# Altium schematic sheet Middle_TID_B.SchDoc
size A4
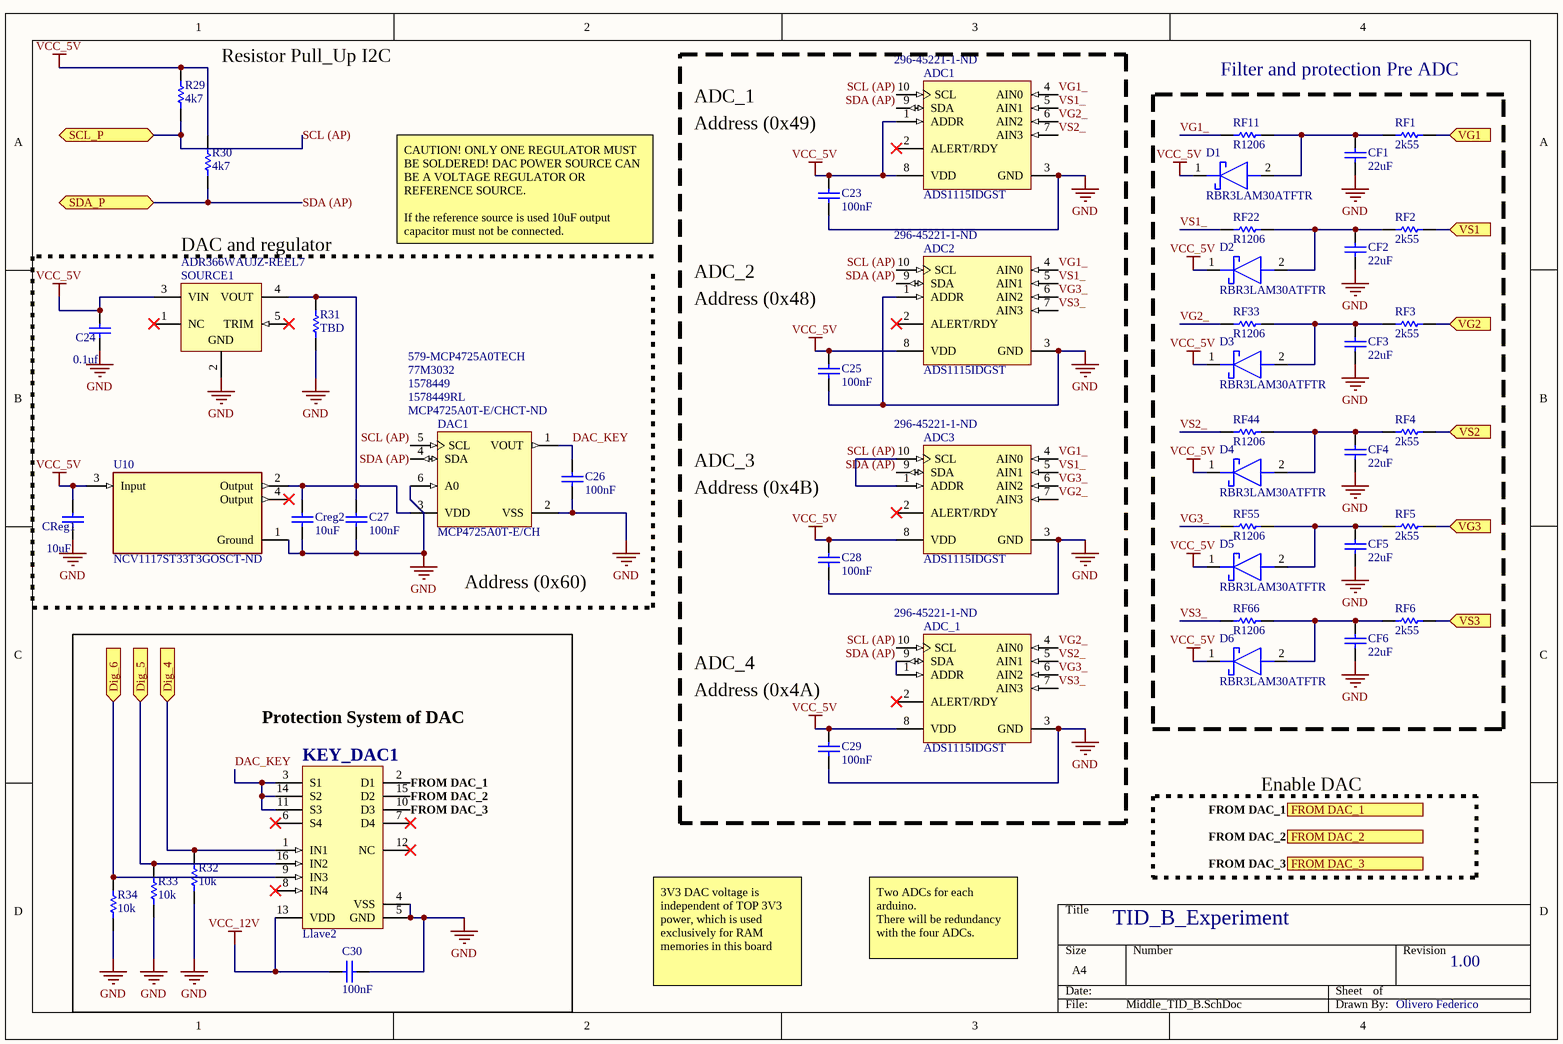
[diagram p0: Middle_TID_B.SchDoc]

## Parts
ADC1  ADS1115IDGST  Supplier Part Number 1: 296-45221-1-ND  [TI-DGS10_N]
ADC2  ADS1115IDGST  Supplier Part Number 1: 296-45221-1-ND  [TI-DGS10_N]
ADC3  ADS1115IDGST  Supplier Part Number 1: 296-45221-1-ND  [TI-DGS10_N]
ADC_1  ADS1115IDGST  Supplier Part Number 1: 296-45221-1-ND  [TI-DGS10_N]
C23  100nF  [C1206]
C24  0.1uf  [C1206]
C25  100nF  [C1206]
C26  100nF  [C1206]
C27  100nF  [C1206]
C28  100nF  [C1206]
C29  100nF  [C1206]
C30  100nF  [C1206]
CF1  22uF  [C1206]
CF2  22uF  [C1206]
CF3  22uF  [C1206]
CF4  22uF  [C1206]
CF5  22uF  [C1206]
CF6  22uF  [C1206]
CReg1  10uF  [C1206]
Creg2  10uF  [C1206]
D1  RBR3LAM30ATFTR  [SODFL4725X105N]
D2  RBR3LAM30ATFTR  [SODFL4725X105N]
D3  RBR3LAM30ATFTR  [SODFL4725X105N]
D4  RBR3LAM30ATFTR  [SODFL4725X105N]
D5  RBR3LAM30ATFTR  [SODFL4725X105N]
D6  RBR3LAM30ATFTR  [SODFL4725X105N]
DAC1  MCP4725A0T-E/CH  Supplier Part Number 1: MCP4725A0T-E/CHCT-ND  Supplier Part Number 2: 1578449RL  Supplier Part Number 3: 1578449  Supplier Part Number 4: 77M3032  Supplier Part Number 5: 579-MCP4725A0TECH  [SOT-23-CH6_N]
KEY_DAC1  Llave2  [ADI-RU-16_N]
R29  4k7  [R1206]
R30  4k7  [R1206]
R31  TBD  [R1206]
R32  10k  [R1206]
R33  10k  [R1206]
R34  10k  [R1206]
RF1  2k55  [R1206]
RF2  2k55  [R1206]
RF3  2k55  [R1206]
RF4  2k55  [R1206]
RF5  2k55  [R1206]
RF6  2k55  [R1206]
RF11  R1206  [R1206]
RF22  R1206  [R1206]
RF33  R1206  [R1206]
RF44  R1206  [R1206]
RF55  R1206  [R1206]
RF66  R1206  [R1206]
SOURCE1  ADR366WAUJZ-REEL7  [ADI-UJ-5_M]
U10  NCV1117ST33T3GOSCT-ND  [FP-318H-MFG]

## Blocks framed on the sheet
Filter and protection Pre ADC: CF1-CF6 D1-D6 RF1-RF6 RF11 RF22 RF33 RF44 RF55 RF66

## Ports
Dig_4 (in), Dig_5 (in), Dig_6 (in), FROM DAC_1 (out), FROM DAC_2 (out), FROM DAC_3 (out), SCL_P (bidir), SDA_P (bidir), VG1 (in), VG2 (in), VG3 (in), VS1 (in), VS2 (in), VS3 (in)

## Nets
GND: ADC1.3(GND) ADC2.1(ADDR) ADC2.3(GND) ADC3.3(GND) ADC_1.3(GND) C23.1 C24.2 C25.1 C26.1 C27.1 C28.1 C29.1 C30.1 CF1.1 CF2.1 CF3.1 CF4.1 CF5.1 CF6.1 CReg1.2 Creg2.1 DAC1.2(VSS) DAC1.6(A0) KEY_DAC1.4(VSS) KEY_DAC1.5(GND) R31.1 R32.1 R33.1 R34.1 SOURCE1.2(GND) U10.1(Ground)
VCC_5V: ADC1.1(ADDR) ADC1.8(VDD) ADC2.8(VDD) ADC3.8(VDD) ADC_1.8(VDD) C23.2 C24.1 C25.2 C28.2 C29.2 CReg1.1 D1.1(K) D2.1(K) D3.1(K) D4.1(K) D5.1(K) D6.1(K) R29.2 R30.2 SOURCE1.3(VIN) U10.3(Input)
VCC_12V: C30.2 KEY_DAC1.13(VDD)
DAC_KEY: C26.2 DAC1.1(VOUT) KEY_DAC1.3(S1) KEY_DAC1.11(S3) KEY_DAC1.14(S2)
Dig_4: KEY_DAC1.1(IN1) R32.2 ; port Dig_4
Dig_5: KEY_DAC1.16(IN2) R33.2 ; port Dig_5
Dig_6: KEY_DAC1.9(IN3) R34.2 ; port Dig_6
FROM DAC_1: KEY_DAC1.2(D1) ; port FROM DAC_1
FROM DAC_2: KEY_DAC1.15(D2) ; port FROM DAC_2
FROM DAC_3: KEY_DAC1.10(D3) ; port FROM DAC_3
SCL (AP): ADC1.10(SCL) ADC2.10(SCL) ADC3.1(ADDR) ADC3.10(SCL) ADC_1.10(SCL) DAC1.5(SCL) R29.1 ; port SCL_P
SDA (AP): ADC1.9(SDA) ADC2.9(SDA) ADC3.9(SDA) ADC_1.1(ADDR) ADC_1.9(SDA) DAC1.4(SDA) R30.1 ; port SDA_P
VG1: RF1.2 ; port VG1
VG1_: ADC1.4(AIN0) ADC2.4(AIN0) ADC3.4(AIN0) RF11.1
VG2: RF3.2 ; port VG2
VG2_: ADC1.6(AIN2) ADC3.7(AIN3) ADC_1.4(AIN0) RF33.1
VG3: RF5.2 ; port VG3
VG3_: ADC2.6(AIN2) ADC3.6(AIN2) ADC_1.6(AIN2) RF55.1
VS1: RF2.2 ; port VS1
VS1_: ADC1.5(AIN1) ADC2.5(AIN1) ADC3.5(AIN1) RF22.1
VS2: RF4.2 ; port VS2
VS2_: ADC1.7(AIN3) ADC_1.5(AIN1) RF44.1
VS3: RF6.2 ; port VS3
VS3_: ADC2.7(AIN3) ADC_1.7(AIN3) RF66.1
NetC27_2: C27.2 Creg2.2 DAC1.3(VDD) R31.2 SOURCE1.4(VOUT) U10.2(Output)
NetCF1_2: CF1.2 D1.2(A) RF1.1 RF11.2
NetCF2_2: CF2.2 D2.2(A) RF2.1 RF22.2
NetCF3_2: CF3.2 D3.2(A) RF3.1 RF33.2
NetCF4_2: CF4.2 D4.2(A) RF4.1 RF44.2
NetCF5_2: CF5.2 D5.2(A) RF5.1 RF55.2
NetCF6_2: CF6.2 D6.2(A) RF6.1 RF66.2

Not connected (* = marked no-connect by the designer): ADC1 2(ALERT/RDY)*; ADC2 2(ALERT/RDY)*; ADC3 2(ALERT/RDY)*; ADC_1 2(ALERT/RDY)*; KEY_DAC1 6(S4)* 7(D4)* 8(IN4)* 12(NC)*; SOURCE1 1(NC)* 5(TRIM)*; U10 4(Output)*

## Notes on the sheet
- (near R29) Resistor Pull_Up I2C
- ADC_1
- Address (0x49)
- DAC and regulator
- CAUTION! ONLY ONE REGULATOR MUST BE SOLDERED! DAC POWER SOURCE CAN BE A VOLTAGE REGULATOR OR REFERENCE SOURCE.
  If the reference source is used 10uF output capacitor must not be connected.
- Address (0x48)
- ADC_2
- Address (0x4B)
- ADC_3
- Address (0x60)
- Protection System of DAC
- (near C29) Address (0x4A)
- ADC_4
- Enable DAC
- TID_B_Experiment
- 3V3 DAC voltage is independent of TOP 3V3 power, which is used exclusively for RAM memories in this board
- Two ADCs for each arduino.
  There will be redundancy with the four ADCs.
- 1.00
- Olivero Federico

## Library data of the parts
ADC1-ADC3 ADC_1 = ADS1115IDGST: 16-Bit ADC with Integrated Multiplexer, PGA, Comparator, Oscillator, and Reference, -40 to 125 degC, 10-pin SOP (DGS10), Green (RoHS & no Sb/Br); Manufacturer: Texas Instruments; # Input Channels: 4; Analog Voltage AV/DD(Max)(V): 5.5; Analog Voltage AV/DD(Min)(V): 2; Architecture: Delta-Sigma; INL(Max)(+/-LSB): 1; Interface: Serial I2C; Resolution(Bits): 16; Sample Rate (max)(SPS): 860; SubFamily: Precision ADC (<=10MSPS); DatasheetVersion: SBAS444B; PackageVersion: 4073272/C, 02/2004; PackageReference: DGS10; PackageDescription: 10-Pin Plastic Small Outline, Body 3 x 3 mm, Pitch 0.5 mm; Digital Supply(Max)(V): 5.5; Digital Supply(Min)(V): 2; Eco-Plan: Green (RoHS & no Sb/Br); Mounting Technology: Surface Mount; Code_JEDEC: MO-153; PartNumber: ADS1115IDGST; ComponentLink1Description: Manufacturer URL; ComponentLink1URL: http://www.ti.com/; ComponentLink2Description: Datasheet; ComponentLink2URL: http://www.ti.com/general/docs/lit/getliterature.tsp?genericPartNumber=ADS1115&fileType=pdf; ComponentLink3Description: Package Specification; ComponentLink3URL: http://www.ti.com/lit/ml/mpds035b/mpds035b.pdf; Supplier 1: Digi-Key
C23-C30 CF1-CF6 CReg1 Creg2 = C1206: 1206 Capacitor; Supplier 1: Digi-Key
  C23-C30: Supplier Part Number 1: 478-1556-1-ND
  CF1-CF6: Supplier Part Number 1: 490-4843-1-ND
  CReg1 Creg2: Supplier Part Number 1: 478-3811-1-ND
D1-D6 = RBR3LAM30ATFTR: Schottky Diode; Manufacturer_Name: ROHM Semiconductor; Datasheet Link: https://componentsearchengine.com/Datasheets/2/RBR3LAM30ATFTR.pdf; Height: 1.05mm; Manufacturer_Part_Number: RBR3LAM30ATFTR; Mouser Part Number: 755-RBR3LAM30ATFTR; Mouser Price/Stock: https://www.mouser.co.uk/ProductDetail/ROHM-Semiconductor/RBR3LAM30ATFTR?qs=4v%252BiZTmLVHGRR7OWAomL%252Bg%3D%3D
DAC1 = MCP4725A0T-E/CH: 12-Bit Digital-to-Analog Converter with EEPROM Memory in SOT-23-6, 6-Pin SOT-23, Extended Temperature, Tape and Reel; Manufacturer: Microchip; DatasheetVersion: revD, Jun-2009; PackageVersion: revBB, Aug-2009; PackageReference: SOT-23-CH6; PackageDescription: 6-Lead Plastic Small Outline Transistor (CH) [SOT-23]; Mounting Technology: Surface Mount; Code_IPC: SOT26A-6; PartNumber: MCP4725A0T-E/CH; ComponentLink1Description: Manufacturer URL; ComponentLink1URL: http://www.microchip.com/; ComponentLink2Description: Datasheet; ComponentLink2URL: http://ww1.microchip.com/downloads/en/DeviceDoc/22039d.pdf; ComponentLink3Description: Package Specification; ComponentLink3URL: http://www.microchip.com/stellent/groups/techpub_sg/documents/packagingspec/en012702.pdf; Supplier 1: Digi-Key; Supplier 2: Farnell; Supplier 3: Farnell; Supplier 4: Newark; Supplier 5: Mouser
KEY_DAC1 = ADG5412BRUZ: High Voltage Latch-Up Proof, Quad SPST Switches, -40 to 125 degC, 16-pin SOP (RU-16), Tube; Manufacturer: Analog Devices; Id, Is (ON): 100pA, 100pA, 100pA, 100pA; Is OFF: 50pA, 50pA, 50pA, 50pA; Power Dissipation: 1mW; Ron (ohms): 9; DatasheetVersion: Rev. A; PackageVersion: Nov-02; PackageReference: RU-16; PackageDescription: 16-Pin Thin Shrink Small Outline Package, Body 5 x 4.4 mm, Pitch 0.65 mm; Supplier 1: Digi-Key; Supplier Part Number 1: ADG5412BRUZ-ND; Supplier 2: Farnell; Supplier Part Number 2: 2081057; Supplier 3: Newark; Supplier Part Number 3: 85R6320; Supplier 4: Mouser; Supplier Part Number 4: 584-ADG5412BRUZ; Configuration: SPST; Packing: Tube; Mounting Technology: Surface Mount; Code_JEDEC: MO-153AB; PartNumber: ADG5412BRUZ; ComponentLink1Description: Manufacturer URL; ComponentLink1URL: http://www.analog.com/en/index.html; ComponentLink2Description: Datasheet; ComponentLink2URL: http://www.analog.com/static/imported-files/data_sheets/ADG5412_5413.pdf; ComponentLink3Description: Package Specification; ComponentLink3URL: http:/www.analog.com/static/imported-files/packages/36244347913743854010197452789RU16.pdf
R29-R34 RF1-RF6 RF11 RF22 RF33 RF44 RF55 RF66 = R1206: 1206 Resistor; Value: *
  R29 R30: Supplier 1: Digi-Key; Supplier Part Number 1: 541-4.7KECT-ND
  R32-R34: Supplier 1: Digi-Key; Supplier Part Number 1: 541-CRCW120610K0JNTACT-ND
  RF1-RF6: Supplier 1: Digi-Key; Supplier Part Number 1: 541-2.55KFCT-ND
SOURCE1 = CMP-0784-00514-1: Low Power, Low Noise Voltage Reference with Sink / Source Capability, 3.3 V Output, 3.6 to 15 V Supply, Automotive, 5-pin SOT23 (UJ-5), Reel; Manufacturer: Analog Devices; Max V Supply (V): 15; Vout: 3.3V; Automotive Qualified: Yes; Min V Supply (V): 3.6; Ref Out TC (ppm/C): 25; ComponentLink1URL: http://www.analog.com/en/index.html; ComponentLink4URL: Product URL:http://www.analog.com/en/special-linear-functions/voltage-references/adr366/products/product.html; ComponentLink1Description: Manufacturer URL; Operating Temp Range: -40 to 125 degC; ComponentLink4Description: URL Link1; DatasheetVersion: Rev. D; PackageReference: UJ-5; PackageDescription: 5-Pin Thin Small Outline Transistor Package, Body 2.9 x 1.6 mm, Pitch 0.95 mm; PartNumber: ADR366WAUJZ-REEL7; Mounting Technology: Surface Mount; Code_JEDEC: MO-193-AB; ComponentLink2Description: Datasheet; ComponentLink3Description: Package Specification; Packing: Reel; ComponentLink2URL: http://www.analog.com/static/imported-files/data_sheets/ADR360_361_363_364_365_366.pdf; ComponentLink3URL: http:/www.analog.com/static/imported-files/packages/PKG_PDF/TSOT(UJ)/UJ_5.pdf; PackageVersion: 100708-A, 10/2008; Supplier 1: Digi-Key
U10 = CMP-07128-000021-1: IC REG LINEAR 3.3V 1A SOT223; Manufacturer: ON Semiconductor; Nominal Supply Current: 6mA; Min Supply Voltage: 2.4V; Number Of Outputs: 1; Standoff Height: 0.02mm; Automotive Grade: Grade 0; Accuracy Percentage: 1%; Max Junction Temp: +150°C; Output Type: Fixed; Dropout Voltage: 1.07V; Max Supply Voltage: 20V; Polarity: Positive; Quiescent Current: 10mA; Package: 318H; ComponentLink2Description: Datasheet; Output Current: 1A; Device Class L1: Integrated Circuits (ICs); Ambient Temperature Range Low: -40°C; Output Voltage: 3.3V; Octopart: https://octopart.com/ncv1117st33t3g-on+semiconductor-1215835; Manufacturer Part Number: NCV1117ST33T3G; Device Class L2: Power Management ICs; ComponentLink2URL: https://www.onsemi.com/pub/Collateral/NCP1117-D.PDF; Ipc Land Pattern Name: SOT230P700X180-4; Digikey Description: IC REG LINEAR 3.3V 1A SOT223; Height: 1.8mm; Ambient Temperature Range High: +125°C; Mouser Description: LDO Voltage Regulators 3.3V 1.0A Automotive; Category: IC; Temperature: -55°C to +150°C; Automotive: Yes; Temperature Range Low: -55°C; Temperature Range High: +150°C; Lead Free: Yes; Device Class L3: Voltage Regulators - Linear; RoHS: TRUE; ComponentLink3Description: New link; ComponentLink3URL: *; Supplier 1: Digi-Key; Supplier 2: Digi-Key; Stock 2: 7309; Pricing 2: 1=0,67000, 10=0,57500, 25=0,53640, 100=0,39850, 250=0,33720, 500=0,32188, 1000=0,23758 (USD); Mount: Surface Mount; Case/Package: SOT-223; Number of Pins: 3; Contact Plating: Tin,Matte; Min Operating Temperature: -40°C; Max Operating Temperature: 125°C; Package Quantity: 1; Packaging: Tape and Reel; Max Input Voltage: 20V; Number of Regulators: 1; Min Current Limit: 1A; Input Bias Current: 6mA; Max Output Current: 1A; Nominal Output Voltage: 3.3V; Accuracy: 1%; Output Voltage Accuracy: 1%; Series: Automotive, AEC-Q100; Length: 6.7mm; Width: 3.7mm; Radiation Hardening: No; REACH SVHC: No SVHC; RoHS Compliant: Yes; ComponentLink1URL: https://datasheet.ciiva.com/2061/ncp1117-d-2061392.pdf?src-supplier=Digi-Key; ComponentLink1Description: https://datasheet.ciiva.com/2061/ncp1117-d-2061392.pdf?src-supplier=Digi-Key; ComponentLink4URL: https://datasheet.ciiva.com/2061/ncp1117-d-2061390.pdf?src-supplier=Digi-Key; ComponentLink4Description: https://datasheet.ciiva.com/2061/ncp1117-d-2061390.pdf?src-supplier=Digi-Key; ComponentLink5URL: https://datasheet.ciiva.com/2061/ncp1117-d-2061391.pdf?src-supplier=Digi-Key; ComponentLink5Description: https://datasheet.ciiva.com/2061/ncp1117-d-2061391.pdf?src-supplier=Digi-Key; Supplier 3: Digi-Key